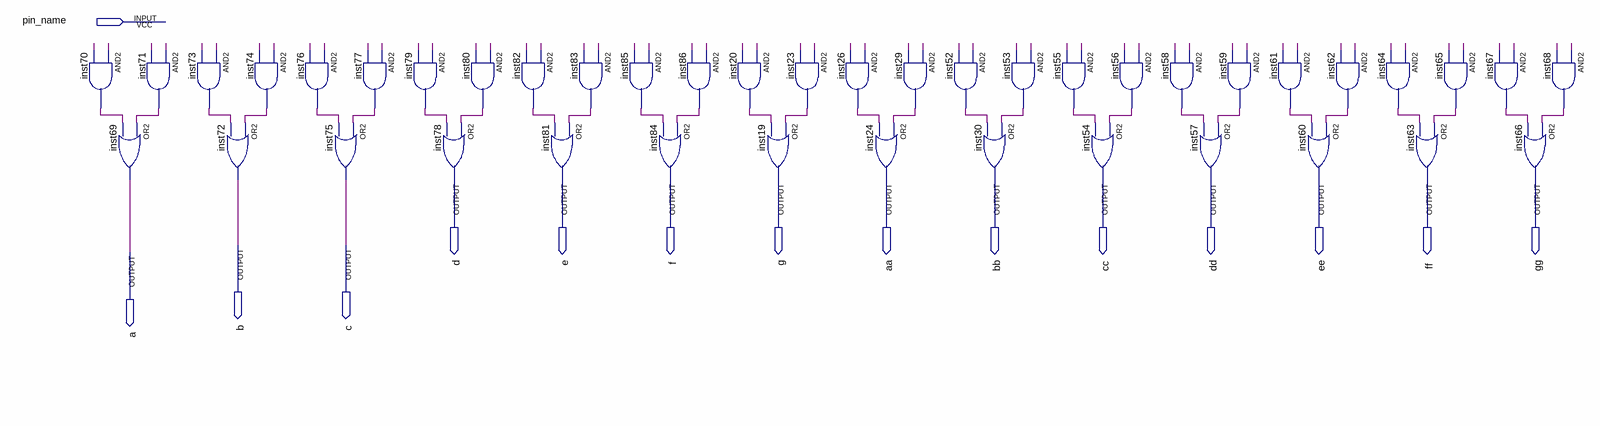
[diagram p0: schematic sheet]
// Quartus schematic LCD.bdf as structural Verilog: 42 symbols, 15 pins
module LCD (
  input  pin_name,
  output d,
  output e,
  output f,
  output g,
  output aa,
  output bb,
  output cc,
  output dd,
  output ee,
  output ff,
  output gg,
  output b,
  output c,
  output a
);

  wire inst20_out, inst23_out, inst26_out, inst29_out, inst52_out, inst53_out, inst55_out, inst56_out,
       inst58_out, inst59_out, inst61_out, inst62_out, inst64_out, inst65_out, inst67_out, inst68_out,
       inst70_out, inst71_out, inst73_out, inst74_out, inst76_out, inst77_out, inst79_out, inst80_out,
       inst82_out, inst83_out, inst85_out, inst86_out, undriven, undriven_2, undriven_3, undriven_4,
       undriven_5, undriven_6, undriven_7, undriven_8, undriven_9, undriven_10, undriven_11, undriven_12,
       undriven_13, undriven_14, undriven_15, undriven_16, undriven_17, undriven_18, undriven_19,
       undriven_20, undriven_21, undriven_22, undriven_23, undriven_24, undriven_25, undriven_26,
       undriven_27, undriven_28, undriven_29, undriven_30, undriven_31, undriven_32, undriven_33,
       undriven_34, undriven_35, undriven_36, undriven_37, undriven_38, undriven_39, undriven_40,
       undriven_41, undriven_42, undriven_43, undriven_44, undriven_45, undriven_46, undriven_47,
       undriven_48, undriven_49, undriven_50, undriven_51, undriven_52, undriven_53, undriven_54,
       undriven_55, undriven_56;

  and inst70 (inst70_out, undriven, undriven_56);
  and inst71 (inst71_out, undriven_15, undriven_29);
  or inst69 (a, inst71_out, inst70_out);
  and inst73 (inst73_out, undriven_2, undriven_55);
  and inst74 (inst74_out, undriven_16, undriven_42);
  or inst72 (b, inst74_out, inst73_out);
  and inst76 (inst76_out, undriven_3, undriven_54);
  and inst77 (inst77_out, undriven_17, undriven_41);
  or inst75 (c, inst77_out, inst76_out);
  and inst79 (inst79_out, undriven_4, undriven_53);
  and inst80 (inst80_out, undriven_18, undriven_40);
  or inst78 (d, inst80_out, inst79_out);
  and inst82 (inst82_out, undriven_5, undriven_52);
  or inst81 (e, inst83_out, inst82_out);
  and inst83 (inst83_out, undriven_19, undriven_39);
  and inst85 (inst85_out, undriven_6, undriven_51);
  or inst84 (f, inst86_out, inst85_out);
  and inst86 (inst86_out, undriven_20, undriven_38);
  and inst20 (inst20_out, undriven_7, undriven_50);
  or inst19 (g, inst23_out, inst20_out);
  and inst23 (inst23_out, undriven_21, undriven_37);
  and inst26 (inst26_out, undriven_8, undriven_49);
  or inst24 (aa, inst29_out, inst26_out);
  and inst29 (inst29_out, undriven_22, undriven_36);
  and inst52 (inst52_out, undriven_9, undriven_48);
  and inst53 (inst53_out, undriven_23, undriven_35);
  or inst30 (bb, inst53_out, inst52_out);
  and inst55 (inst55_out, undriven_10, undriven_47);
  and inst56 (inst56_out, undriven_24, undriven_34);
  or inst54 (cc, inst56_out, inst55_out);
  and inst58 (inst58_out, undriven_11, undriven_46);
  and inst59 (inst59_out, undriven_25, undriven_33);
  or inst57 (dd, inst59_out, inst58_out);
  and inst61 (inst61_out, undriven_12, undriven_45);
  and inst62 (inst62_out, undriven_26, undriven_32);
  or inst60 (ee, inst62_out, inst61_out);
  and inst64 (inst64_out, undriven_13, undriven_44);
  or inst63 (ff, inst65_out, inst64_out);
  and inst65 (inst65_out, undriven_27, undriven_31);
  and inst67 (inst67_out, undriven_14, undriven_43);
  or inst66 (gg, inst68_out, inst67_out);
  and inst68 (inst68_out, undriven_28, undriven_30);
endmodule
